# EAGLE design dummyvideo (EAGLE 6.5.0)
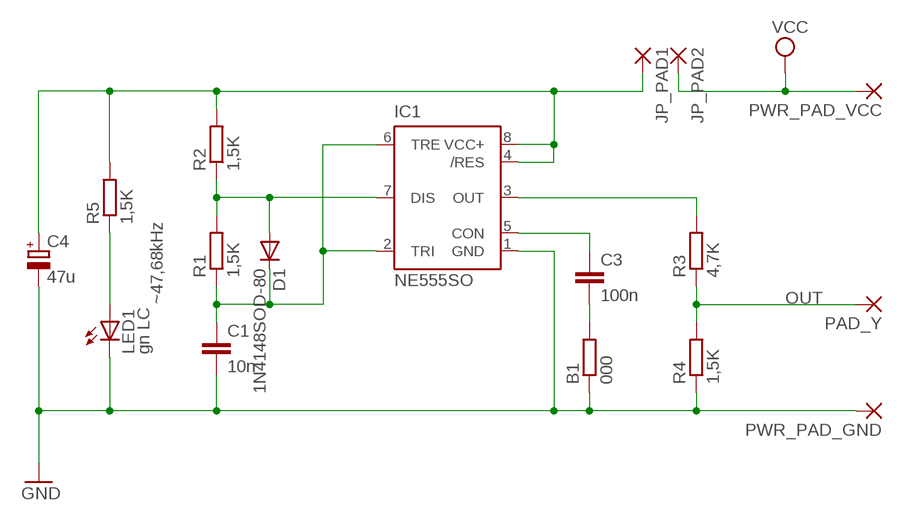
[diagram p0: schematic, sheet 1]

## Parts
B1  000  R-EU_R1206  [R1206]
C1  10n  C-EUC0805  [C0805]
C3  100n  C-EUC0805  [C0805]
C4  47u  CPOL-EU153CLV-0505  [153CLV-0505]
D1  1N4148SOD-80  [SOD80C]
IC1  NE555SO  [SO08]
JP_PAD1  SMD2  [SMD1,27-2,54]
JP_PAD2  SMD2  [SMD1,27-2,54]
LED1  gn LC  LEDCHIP-LED0603  [CHIP-LED0603]
PAD_Y  SMD2  [SMD1,27-2,54]
PWR_PAD_GND  SMD2  [SMD1,27-2,54]
PWR_PAD_VCC  SMD2  [SMD1,27-2,54]
R1  1,5K  R-EU_R0805  [R0805]
R2  1,5K  R-EU_M0805  [M0805]
R3  4,7K  R-EU_R0805  [R0805]
R4  1,5K  R-EU_R0805  [R0805]
R5  1,5K  R-EU_R0805  [R0805]

## Nets
GND: B1.1 B1.2 C1.2 C3.2 C4.- IC1.1(GND) LED1.C PWR_PAD_GND.1(P) R4.1
N$1: D1.A IC1.7(DIS) R1.2 R2.1
N$2: C3.1 IC1.5(CON)
N$3: C1.1 D1.C IC1.2(TRI) IC1.6(TRE) R1.1
N$4: IC1.3(OUT) R3.2
N$5: LED1.A R5.1
OUT: PAD_Y.1(P) R3.1 R4.2
VCC: JP_PAD2.1(P) PWR_PAD_VCC.1(P)
VCC_SW: C4.+ IC1.4(/RES) IC1.8(VCC+) JP_PAD1.1(P) R2.2 R5.2

## Notes on the sheet
- ~47,68kHz

## Library data of the parts
B1 R1-R5 = resistor:R-EU_: RESISTOR, European symbol
C1 C3 = resistor:C-EU: CAPACITOR, European symbol
C4 = resistor:CPOL-EU: POLARIZED CAPACITOR, European symbol
D1 = n39:1N4148: DIODE high speed (Philips) Copied from diode.lbr
IC1 = n39:NE555: General purpose bipolar Timer Copied from st-microelectronics.lbr; MPN: NE555D; OC_REICHELT: NE 555 D SMD
JP_PAD1 JP_PAD2 PAD_Y PWR_PAD_GND PWR_PAD_VCC = wirepad:SMD2: SMD PAD
LED1 = led:LED: LED OSRAM: - CHIPLED LG R971, LG N971, LY N971, LG Q971, LY Q971, LO R971, LY R971 LH N974, LH R974 LS Q976, LO Q976, LY Q976 LO Q996 - Hyper CHIPLED LW Q18S LB Q993, LB Q99A, LB R99A - SideLED LS A670, LO A670, LY A670, LG A670, LP A670 LB A673, LV A673, LT A673, LW A673 LH A674 LY A675 LS A676, LA A676, LO A676, LY A676, LW A676 LS A679, LY A679, LG A679 - Hyper Micro SIDELED® LS Y876, LA Y876, LO Y876, LY Y876 LT Y87S - SmartLED LW L88C, LW L88S LB L89C, LB L89S, LG L890 LS L89K, LO L89K, LY L89K LS L896, LA L896, LO L896, LY L896 - TOPLED LS T670, LO T670, LY T670, LG T670, LP T670 LSG T670, LSP T670, LSY T670, LOP T670, LYG T670 LG T671, LOG T671, LSG T671 LB T673, LV T673, LT T673, LW T673 LH T674 LS T676, LA T676, LO T676, LY T676, LB T676, LH T676, LSB T676, LW T676 LB T67C, LV T67C, LT T67C, LS T67K, LO T67K, LY T67K, LW E67C LS E67B, LA E67B, LO E67B, LY E67B, LB E67C, LV E67C, LT E67C LW T67C LS T679, LY T679, LG T679 LS T770, LO T770, LY T770, LG T770, LP T770 LB T773, LV T773, LT T773, LW T773 LH T774 LS E675, LA E675, LY E675, LS T675 LS T776, LA T776, LO T776, LY T776, LB T776 LHGB T686 LT T68C, LB T68C - Hyper Mini TOPLED® LB M676 - Mini TOPLED Santana® LG M470 LS M47K, LO M47K, LY M47K Source: http://www.osram.convergy.de LUXEON: - LUMILED® LXK2-PW12-R00, LXK2-PW12-S00, LXK2-PW14-U00, LXK2-PW14-V00 LXK2-PM12-R00, LXK2-PM12-S00, LXK2-PM14-U00 LXK2-PE12-Q00, LXK2-PE12-R00, LXK2-PE12-S00, LXK2-PE14-T00, LXK2-PE14-U00 LXK2-PB12-K00, LXK2-PB12-L00, LXK2-PB12-M00, LXK2-PB14-N00, LXK2-PB14-P00, LXK2-PB14-Q00 LXK2-PR12-L00, LXK2-PR12-M00, LXK2-PR14-Q00, LXK2-PR14-R00 LXK2-PD12-Q00, LXK2-PD12-R00, LXK2-PD12-S00 LXK2-PH12-R00, LXK2-PH12-S00 LXK2-PL12-P00, LXK2-PL12-Q00, LXK2-PL12-R00 Source: www.luxeon.com KINGBRIGHT: KA-3528ASYC Source: www.kingbright.com

## Board
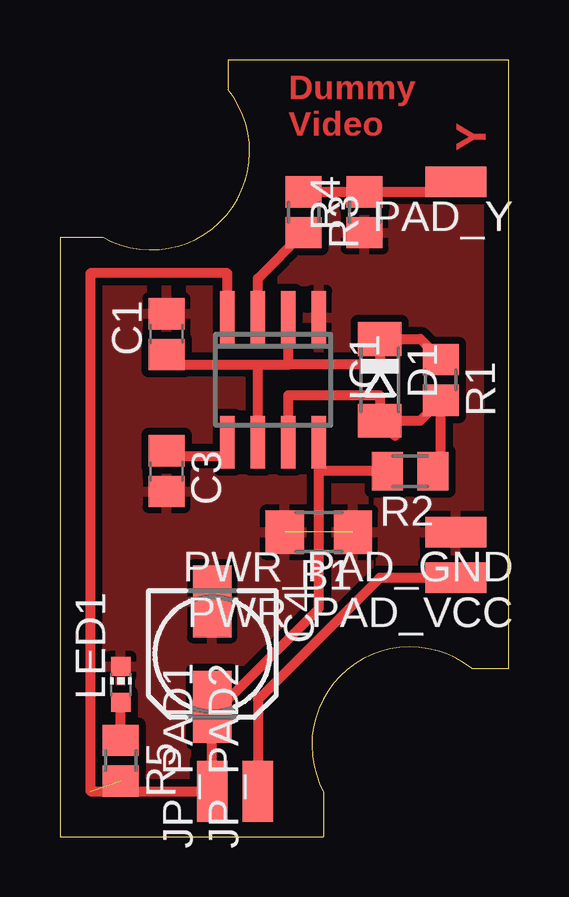
[diagram p1: board, top side]

Size 18.72 x 32.38 mm. Coordinates in mm from the lower left corner, seen from the top.
Outline: 7.01,31.14 7.01,32.38 18.72,32.38 18.72,7.01 17.17,7.01 arc157 11,1.85
Outline: 7.01,31.14 arc-158 1.8,24.99 0,24.99 0,0 11,0 11,1.85
Copper layers (1*16): Top 0.035mm / dielectric 1.5mm / Bottom 0.035mm
Design rules "default": minimum track width 10mil, minimum drill 24mil, track to track 8mil, track to pad 8mil, pad to pad 8mil, via to via 8mil, smd to smd 8mil, copper to edge 40mil, drill to drill 8mil, minimum pad ring 10mil, minimum via ring 8mil, stop-mask expansion 4mil, vias tented up to drill 0mil, thermal gap 10mil

### Footprints (pad centres in the part's own frame; a part is rotated, then mirrored left to right if it is on the bottom)
R1206 = smd 1.6 x 1.803: 1 -1.422,0; 2 1.422,0
C0805 = smd 1.3 x 1.5: 1 -0.85,0; 2 0.85,0
153CLV-0505 = smd 3 x 1.6: + 2.2,0; - -2.2,0
SOD80C = smd 1.4 x 1.8: A 1.7,0; C -1.7,0
SO08 = smd 0.6 x 2.2: 1 -1.905,-2.6; 2 -0.635,-2.6; 3 0.635,-2.6; 4 1.905,-2.6; 5 1.905,2.6; 6 0.635,2.6; 7 -0.635,2.6; 8 -1.905,2.6
SMD1,27-2,54 = smd 1.27 x 2.54: 1 0,0
CHIP-LED0603 = smd 0.8 x 0.8: A 0,-0.75; C 0,0.75
R0805 = smd 1.3 x 1.5: 1 -0.85,0; 2 0.85,0
M0805 = smd 1.3 x 1.6: 1 -0.95,0; 2 0.95,0

### Placement (x,y rotation side)
B1  10.79,12.7 180 top
C1  4.45,20.95 90 top
C3  4.45,15.24 270 top
C4  6.35,7.62 270 top
D1  13.34,19.05 270 top
IC1  8.89,19.05 180 top
JP_PAD1  6.35,1.91 0 top
JP_PAD2  8.26,1.91 0 top
LED1  2.54,6.35 0 top
PAD_Y  16.51,27.3 90 top
PWR_PAD_GND  16.51,12.7 90 top
PWR_PAD_VCC  16.51,10.79 90 top
R1  15.88,19.05 270 top
R2  14.61,15.24 180 top
R3  470R  [R0805]  10.16,26.04 270 top
R4  150R  [R0805]  12.7,26.04 90 top
R5  2.54,3.17 270 top

### Tracks (layer width: path | path; a pad name or v marks a point on that pad's centre or on a via)
GND  (1 unrouted)
  pour Top (isolate 0.305): 0,32.38 18.41,32.38 18.41,0 0,0
N$1
  Top 0.406: 13.97,16.71 D1.A | D1.A 15.03,17.35 R1.2 15.88,15.56 R2.1 | IC1.7 9.53,18.41 13.34,18.41 D1.A
N$2
  Top 0.406: C3.1 4.66,15.88 6.99,15.88 IC1.5
N$3
  Top 0.406: R1.1 15.03,20.75 D1.C 13.34,19.68 9.53,19.68 | 9.53,19.68 IC1.2 | IC1.6 8.26,19.68 | C1.1 4.87,19.68 8.26,19.68 | 8.26,19.68 9.53,19.68
N$4
  Top 0.406: IC1.3 8.26,23.28 R3.2
N$5
  Top 0.406: R5.1 LED1.A
OUT
  Top 0.406: R3.1 R4.2 16.73,26.89 PAD_Y.1
VCC
  Top 0.406: PWR_PAD_VCC.1 13.34,10.79 8.26,5.71 JP_PAD2.1
VCC_SW  (1 unrouted)
  Top 0.406: R2.2 10.79,15.24 | 10.79,15.24 IC1.8 | C4.+ JP_PAD1.1 1.27,1.91 1.27,23.5 6.99,23.5 IC1.4 | C4.+ 6.69,5.42 10.79,9.53 10.79,15.24 | 6.27,5.5 C4.+

### Text on the board
Top: Dummy / Video | Y